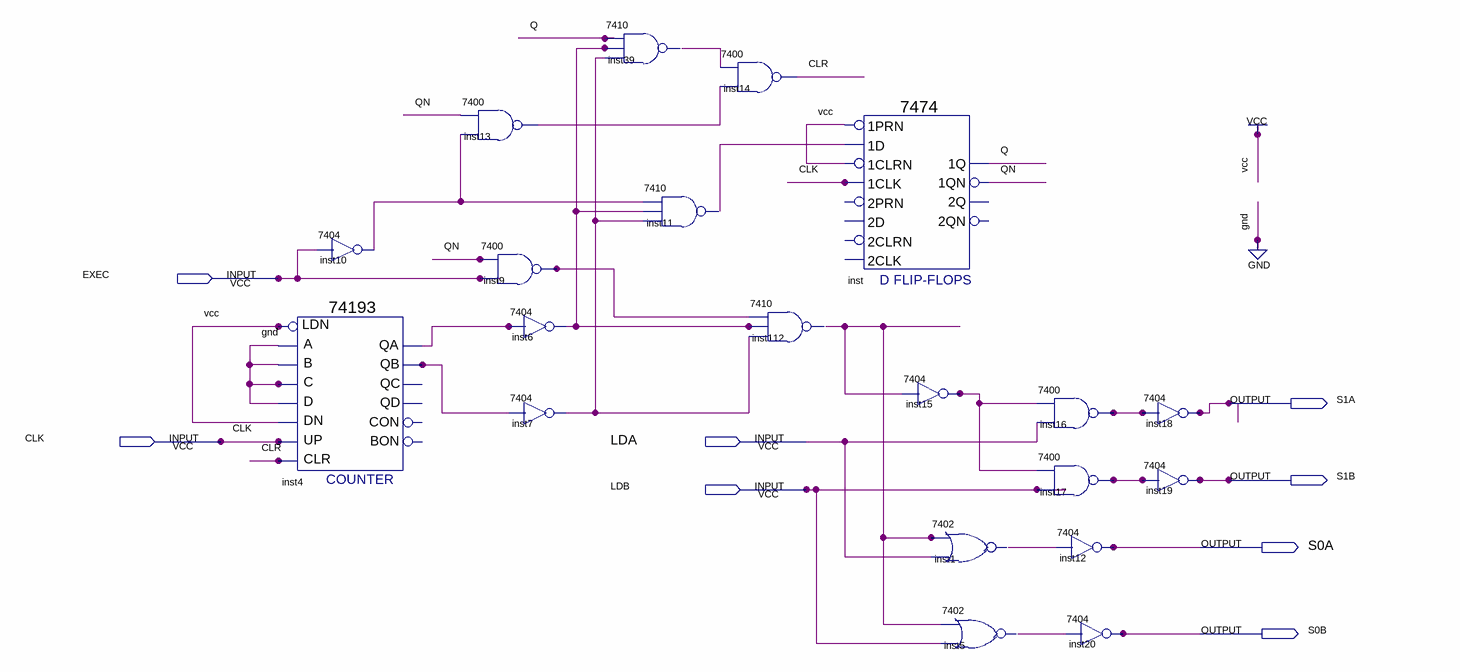
[diagram p0: schematic sheet]
// Quartus schematic control_unit.bdf as structural Verilog: 20 symbols, 8 pins
module control_unit (
  input  EXEC,
  input  CLK,
  input  LDA,
  input  LDB,
  output S1A,
  output S1B,
  output S0A,
  output S0B
);

  wire CLR, inst1_1, inst4_qa, inst4_qb, inst5_1, inst6_1, inst7_1, inst9_1, inst10_1, inst11_1, inst13_1,
       inst15_1, inst16_1, inst17_1, inst39_1, inst112_1, Q, QN;

  \74193  inst4 (
    .D(1'b0), .C(1'b0), .B(1'b0), .A(1'b0), .CLR(CLR), .UP(CLK), .DN(1'b1), .LDN(1'b1), .QB(inst4_qb),
    .QA(inst4_qa));  // open: CON, QD, QC, BON
  \7404  inst10 (.\2 (EXEC), .\1 (inst10_1));
  \7400  inst13 (.\3 (inst10_1), .\2 (QN), .\1 (inst13_1));
  \7400  inst9 (.\3 (EXEC), .\2 (QN), .\1 (inst9_1));
  \7404  inst6 (.\2 (inst4_qa), .\1 (inst6_1));
  \7404  inst7 (.\2 (inst4_qb), .\1 (inst7_1));
  \7410  inst39 (.\2 (Q), .\3 (inst6_1), .\4 (inst7_1), .\1 (inst39_1));
  \7410  inst11 (.\2 (inst10_1), .\3 (inst6_1), .\4 (inst7_1), .\1 (inst11_1));
  \7400  inst14 (.\3 (inst13_1), .\2 (inst39_1), .\1 (CLR));
  \7410  inst112 (.\2 (inst9_1), .\3 (inst6_1), .\4 (inst7_1), .\1 (inst112_1));
  \7474  inst (
    .\1CLK (CLK), .\1D (inst11_1), .\1PRN (1'b1), .\1CLRN (1'b1), .\1QN (QN), .\1Q (Q));  // open: 2D, 2PRN, 2CLK, 2CLRN, 2Q, 2QN
  \7404  inst15 (.\2 (inst112_1), .\1 (inst15_1));
  \7402  inst1 (.\2 (inst112_1), .\3 (LDA), .\1 (inst1_1));
  \7402  inst5 (.\2 (inst112_1), .\3 (LDB), .\1 (inst5_1));
  \7400  inst16 (.\3 (LDA), .\2 (inst15_1), .\1 (inst16_1));
  \7400  inst17 (.\3 (LDB), .\2 (inst15_1), .\1 (inst17_1));
  \7404  inst12 (.\2 (inst1_1), .\1 (S0A));
  \7404  inst20 (.\2 (inst5_1), .\1 (S0B));
  \7404  inst18 (.\2 (inst16_1), .\1 (S1A));
  \7404  inst19 (.\2 (inst17_1), .\1 (S1B));
endmodule
